# Altium project HIL_RIG_Hardware.PrjPcb (part 4 of 11)

## Sheet  Digital_Output.SchDoc
size A3; SheetNumber: 11; SheetTotal: 29
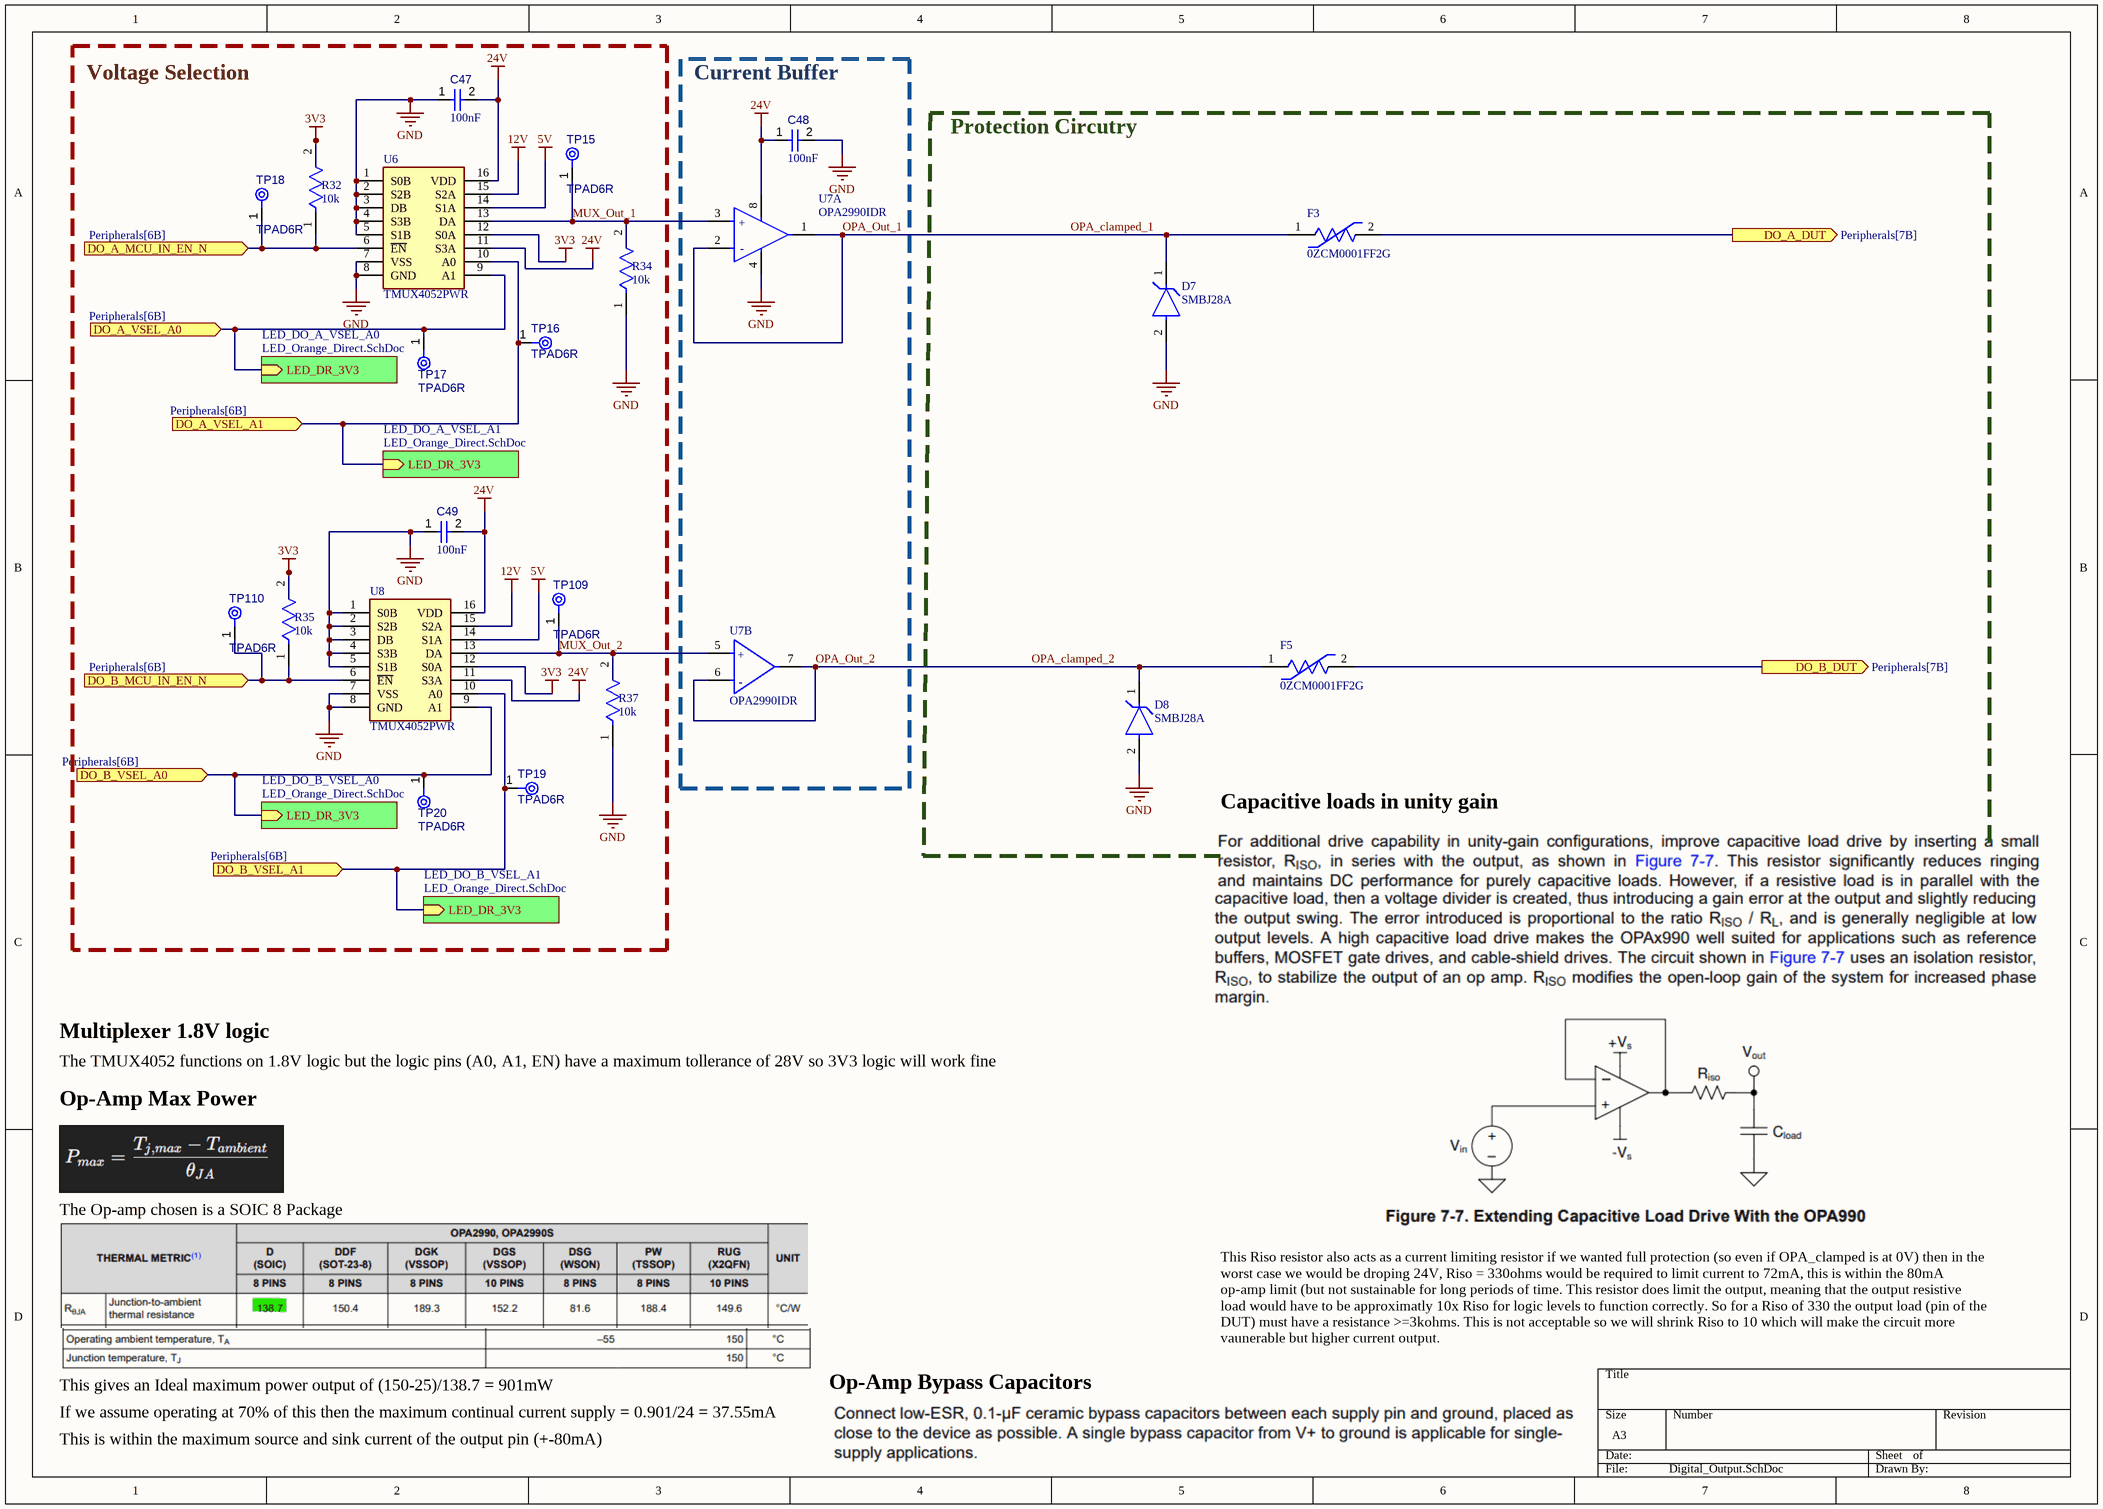
[diagram p7:  Digital_Output.SchDoc]

### Parts
C47  value 100nF  [CAPC1608X90X40NL10T20]  (hidden comment: Capacitor 100 nF +/-10% 50 V 0603)
C48  value 100nF  [CAPC1608X90X40NL10T20]  (hidden comment: Capacitor 100 nF +/-10% 50 V 0603)
C49  value 100nF  [CAPC1608X90X40NL10T20]  (hidden comment: Capacitor 100 nF +/-10% 50 V 0603)
D7  SMBJ28A  [FP-SMBJ-MFG]
D8  SMBJ28A  [FP-SMBJ-MFG]
F3  0ZCM0001FF2G  [FP-0ZCM0001FF2G-MFG]
F5  0ZCM0001FF2G  [FP-0ZCM0001FF2G-MFG]
R32  value 10k  [FP-RT0603-IPC_C]  (hidden comment: RT0603BRD0710KL)
R34  value 10k  [FP-RT0603-IPC_C]  (hidden comment: RT0603BRD0710KL)
R35  value 10k  [FP-RT0603-IPC_C]  (hidden comment: RT0603BRD0710KL)
R37  value 10k  [FP-RT0603-IPC_C]  (hidden comment: RT0603BRD0710KL)
TP15  TPAD6R  [TP06R]  (no BOM)
TP16  TPAD6R  [TP06R]  (no BOM)
TP17  TPAD6R  [TP06R]  (no BOM)
TP18  TPAD6R  [TP06R]  (no BOM)
TP19  TPAD6R  [TP06R]  (no BOM)
TP20  TPAD6R  [TP06R]  (no BOM)
TP109  TPAD6R  [TP06R]  (no BOM)
TP110  TPAD6R  [TP06R]  (no BOM)
U6  TMUX4052PWR  [SOP65P640X120-16N]
U7  OPA2990IDR  [FP-D0008A-IPC_A]  (parts A,B of 2)
U8  TMUX4052PWR  [SOP65P640X120-16N]

### Blocks framed on the sheet
Voltage Selection: C47 C49 R32 R34 R35 R37 TP15-TP20 TP109 TP110 U6 U8
Current Buffer: C48 U7

### Sub-sheets
LED_DO_A_VSEL_A0 = LED_Orange_Direct.SchDoc (file not in this document): LED_DR_3V3 (in)
LED_DO_A_VSEL_A1 = LED_Orange_Direct.SchDoc (file not in this document): LED_DR_3V3 (in)
LED_DO_B_VSEL_A0 = LED_Orange_Direct.SchDoc (file not in this document): LED_DR_3V3 (in)
LED_DO_B_VSEL_A1 = LED_Orange_Direct.SchDoc (file not in this document): LED_DR_3V3 (in)

### Ports
DO_A_DUT (out, see Peripherals[7B]), DO_A_MCU_IN_EN_N (in, see Peripherals[6B]), DO_A_VSEL_A0 (in, see Peripherals[6B]), DO_A_VSEL_A1 (in, see Peripherals[6B]), DO_B_DUT (out, see Peripherals[7B]), DO_B_MCU_IN_EN_N (in, see Peripherals[6B]), DO_B_VSEL_A0 (in, see Peripherals[6B]), DO_B_VSEL_A1 (in, see Peripherals[6B])

### Nets
3V3: R32.2 R35.2 U6.12(S0A) U8.12(S0A)
5V: U6.14(S1A) U8.14(S1A)
12V: U6.15(S2A) U8.15(S2A)
24V: C47.2 C48.1 C49.2 U6.11(S3A) U6.16(VDD) U7.8(V+) U8.11(S3A) U8.16(VDD)
GND: C47.1 C48.2 C49.1 D7.2(A) D8.2(A) R34.1 R37.1 U6.1(S0B) U6.2(S2B) U6.3(DB) U6.4(S3B) U6.5(S1B) U6.7(VSS) U6.8(GND) U7.4(V-) U8.1(S0B) U8.2(S2B) U8.3(DB) U8.4(S3B) U8.5(S1B) U8.7(VSS) U8.8(GND)
MUX_Out_1: R34.2 TP15.1(TP) U6.13(DA) U7.3(IN1+)
MUX_Out_2: R37.2 TP109.1(TP) U7.5(IN2+) U8.13(DA)
OPA_clamped_1: D7.1(C) F3.1 U7.1(OUT1) U7.2(IN1-)  [also labelled OPA_Out_1]
OPA_clamped_2: D8.1(C) F5.1 U7.6(IN2-) U7.7(OUT2)  [also labelled OPA_Out_2]
NetF3_2: F3.2 ; port DO_A_DUT
NetF5_2: F5.2 ; port DO_B_DUT
NetR32_1: R32.1 TP18.1(TP) U6.6(~{EN}) ; port DO_A_MCU_IN_EN_N
NetR35_1: R35.1 TP110.1(TP) U8.6(~{EN}) ; port DO_B_MCU_IN_EN_N
NetTP16_1: TP16.1(TP) U6.10(A0) ; port DO_A_VSEL_A1, sheet LED_DO_A_VSEL_A1/LED_DR_3V3
NetTP17_1: TP17.1(TP) U6.9(A1) ; port DO_A_VSEL_A0, sheet LED_DO_A_VSEL_A0/LED_DR_3V3
NetTP19_1: TP19.1(TP) U8.10(A0) ; port DO_B_VSEL_A1, sheet LED_DO_B_VSEL_A1/LED_DR_3V3
NetTP20_1: TP20.1(TP) U8.9(A1) ; port DO_B_VSEL_A0, sheet LED_DO_B_VSEL_A0/LED_DR_3V3

### Notes on the sheet
- Protection Circutry
- Capacitive loads in unity gain
- Multiplexer 1.8V logic
- The TMUX4052 functions on 1.8V logic but the logic pins (A0, A1, EN) have a maximum tollerance of 28V so 3V3 logic will work fine
- Op-Amp Max Power
- The Op-amp chosen is a SOIC 8 Package
- This gives an Ideal maximum power output of (150-25)/138.7 = 901mW
- Op-Amp Bypass Capacitors
- This Riso resistor also acts as a current limiting resistor if we wanted full protection (so even if OPA_clamped is at 0V) then in the worst case we would be droping 24V, Riso = 330ohms would be required to limit current to 72mA, this is within the 80mA op-amp limit (but not sustainable for long periods of time. This resistor does limit the output, meaning that the output resistive load would have to be approximatly 10x Riso for logic levels to function correctly. So for a Riso of 330 the output load (pin of the DUT) must have a resistance >=3kohms. This is not acceptable so we will shrink Riso to 10 which will make the circuit more vaunerable but higher current output.
- If we assume operating at 70% of this then the maximum continual current supply = 0.901/24 = 37.55mA
- This is within the maximum source and sink current of the output pin (+-80mA)

### Library data of the parts
C47-C49 = CMP-001-00017-6: as C28 on sheet  Digital_Input; Tolerance: 10%; Mounting Technology: SM; Max Operating Temperature: 125°C; RoHS Compliant: True; Pins: 2; Case/Package: 0603; Min Operating Temperature: -55°C
D7 D8 = CMP-004-00070-1: Tvs Diodes & Esd Suppressors; SMBJ28A; Littelfuse; 28 V; 45.4 V; 31.1 V; 31.1 V; Power Line Protection: No; Clamping Voltage: 45.4V; Number of Channels: 1; Power Rating: 600W; Voltage Rating (DC): 28V; Polarity: Unidirectional; Breakdown Voltage: 32.75V; Element Configuration: Single; Leakage Current: 1µA; Current: 1mA; Max Breakdown Voltage: 34.4V; Forward Voltage: 3.5V; Max Power Dissipation: 5W; Min Breakdown Voltage: 31.1V; Max Junction Temperature (Tj): 150°C; Max Surge Current: 13.3A; Height: 2.61mm; Number of Elements: 1; Power Dissipation: 600W; Case/Package: SMB; Termination: SMD/SMT; Radiation Hardening: No; Mounting Technology: Surface Mount; Lifecycle Status: Production; Direction: Unidirectional; Number of Unidirectional Channels: 1; Reverse Voltage: 28V; Peak Reverse Current: 1µA; Voltage: 28V; Operating Supply Voltage: 28V; Min Operating Temperature: -65°C; Schedule B: 8541100080, 8541100080; REACH SVHC: No; Length: 4.57mm; Packaging: Cut Tape; Country of Origin: Mainland China, Philippines; Test Current: 1mA; Introduction Date: 1996-01-01; Lead Free: Lead Free; Max Operating Temperature: 150°C; Composition: Zener; Pins: 2; Width: 3.94mm; Number of Terminals: 2; Reverse Standoff Voltage: 28V; Harmonized Tariff Schedule (HTS) Code: 8541.10.00.50; RoHS: Compliant; Peak Pulse Power: 600W; Export Control Classification Number (ECCN) Code: EAR99; Max Reverse Leakage Current: 1µA; Reverse Breakdown Voltage: 31.1V; Peak Pulse Current: 13.3A
F3 F5 = CMP-005-00023-1: Prices include import duty and tax. RESETTABLE PTC FUSE, SMD, 0603 SIZE, 10MA, 60V;; Trip Current: 30mA; Value: 15Ω; Maximum Resistance 1 Hour (R1max): 100Ω; Ratings: AEC-Q200, TUV; Time to Trip: 1s; Current Rating: 40A; REACH SVHC: Yes; Voltage Rating: 60V; Harmonized Tariff Schedule (HTS) Code: 8533.40.80.70; Mounting Technology: Surface Mount; Length: 1.8mm; Min Operating Temperature: -40°C; Max Operating Temperature: 85°C; Width: 1mm; Export Control Classification Number (ECCN) Code: EAR99; Height: 850µm; Working Voltage: 60V; Case/Package: 0603; RoHS: Compliant; Lifecycle Status: Production; Hold Current: 10mA; Number of Terminals: 2; China RoHS: Compliant; Introduction Date: 2019-09-26
R32 R34 R35 R37 = CMP-009-00322-1: as R7 on sheet  Digital_Input; Min Operating Temperature: -55°C; Case/Package: 0603; Mounting Technology: Surface Mount; Max Operating Temperature: 155°C; Tolerance: 0.1%; Case Code (Imperial): 0603; China RoHS: Non-Compliant; Composition: Thin Film; Country of Origin: Mainland China, Taiwan; Depth: 800µm; Export Control Classification Number (ECCN) Code: EAR99; Features: Moisture Resistant; Harmonized Tariff Schedule (HTS) Code: 8533.21.00.30; Height: 450µm; Introduction Date: 2008-06-09; Lead Free: Lead Free; Length: 1.6mm; Lifecycle Status: Production; Military Standard: Not; Number of Terminals: 2; Number of Terminations: 2; Power Rating: 100mW; REACH SVHC: Yes; RoHS: Compliant; Schedule B: 8533210045, 8533210045; Termination: SMD/SMT; Voltage Rating (DC): 75V; Weight: 2.012816mg; Width: 800µm; Working Voltage: 75V
TP15-TP20 TP109 TP110 = CMP-00028-00002-2: 0.6mm round; Pins: 1
U6 U8 = CMP-031-00021-1: Texas Instruments; Arrow Price/Stock: https://www.arrow.com/en/products/tmux4052pwr/texas-instruments.html?utm_currency=USD&region=nac; Manufacturer_Name: Texas Instruments; Manufacturer_Part_Number: TMUX4052PWR; Datasheet Link: https://www.ti.com/lit/ds/symlink/tmux4052.pdf?ts=1676371866155&ref_url=https%253A%252F%252Fwww.ti.com%252Fproduct%252FTMUX4052; Mouser Price/Stock: https://www.mouser.co.uk/ProductDetail/Texas-Instruments/TMUX4052PWR?qs=amGC7iS6iy8OsL8GnYryxg%3D%3D; Arrow Part Number: TMUX4052PWR; Height: 1.2mm; Source: MAX17643ATC+.SchLib; Design Item ID: TMUX4052PWR; Mouser Part Number: 595-TMUX4052PWR
U7 = CMP-014-00003-1: IC OPAMP GP 2 CIRCUIT 8SOIC / General Purpose Amplifier 2 Circuit Rail-to-Rail 8-SOIC; Manufacturer Lifecycle Status: ACTIVE; Output Current per Channel: 80mA; Max Junction Temperature (Tj): 150°C; Max Dual Supply Voltage: 20V; Min Dual Supply Voltage: 1.35V; Number of Channels: 2; Input Offset Voltage (Vos): 300µV; Input Bias Current: 10pA; Max Supply Voltage: 40V; Nominal Supply Current: 120µA; Min Supply Voltage: 2.7V; Ambient Temperature Range High: 125°C; Schedule B: 8542330000; Height: 1.75mm; Pins: 8; Length: 4.9mm; Width: 3.91mm; Max Operating Temperature: 125°C; Case/Package: SOIC; Lifecycle Status: Production; RoHS: Compliant; Thickness: 1.58mm; Min Operating Temperature: -40°C

## Sheet  PWM_Input.SchDoc
size A3; SheetNumber: 12; SheetTotal: 29; SPICEModelCacheULSDJOQO: <root> / <DocumentId>ULSDJOQO</DocumentId> / <CacheFrame Number="0"> / <Model Name="logic_pp_output_lvc_1i_nand_pp_cmos_sn74lvc1g04" Kind="CKT"> / <Text>.SUBCKT LOGIC_PP_OUTPUT_LVC_1i_NAND_PP_CMOS_SN74LVC1G04 IN OUT VCC VEE / EROH NROH VEE TABLE {V(VCC,VEE)} = / +(1.65,112.5) / +(2.3,50) / +(3,37.5) / +(4.5,21.875) / EROL NROL VEE TABLE {V(VCC,VEE)} = / +(1.65,112.5) / +(2.3,37.5) / +(3,25) / +(4.5,17.1875) / E1 N1 VEE VALUE = {V(VCC,VEE)*V(IN,VEE)} / GOUT N1 OUT VALUE = {V(N1,OUT)*(V(IN,VEE)/V(NROH,VEE) + (1 - V(IN,VEE))/V(NROL,VEE))} / .ENDS</Text> / </Model> / <Model Name="logic_input_lvc_1i_nand_pp_cmos_sn74lvc1g04" Kind="CKT"> / <Text>.SUBCKT LOGIC_INPUT_LVC_1i_NAND_PP_CMOS_SN74LVC1G04 OUT IN VCC VEE / .PARAM STANDARD_INPUT_SELECT = 1 / .PARAM SCHMITT_TRIGGER_INPUT_SELECT = 0 / ESTD_THR VSTD_THR VEE TABLE {V(VCC,VEE)} = / +(1,0.5) / +(1.8,0.9) / +(2.5,1.25) / +(3.3,1.65) / +(5,2.5) / +(6,3) / ETRP_P VTRP_P VEE TABLE {V(VCC,VEE)} = / +(1.65,0.9) / +(2.3,1.25) / +(3,1.7) / +(4.5,2.45) / +(5.5,3) / ETRP_N VTRP_N VEE TABLE {V(VCC,VEE)} = / +(1.65,0.45) / +(2.3,0.7) / +(3,1.05) / +(4.5,1.72) / +(5.5,2.1) / EHYST VHYST VEE TABLE {V(VCC,VEE)} = / +(1.65,0.45) / +(2.3,0.55) / +(3,0.65) / +(4.5,0.73) / +(5.5,0.9) / ETRUE NTRUE VEE VALUE = {V(VCC,VEE)} / EFALSE NFALSE VEE VALUE = {0} / EBETA BETA VEE VALUE = {V(VHYST,VEE)/(V(NTRUE,VEE) - V(NFALSE,VEE) + V(VHYST,VEE))} / EFB NFB VEE VALUE = {(1 - V(BETA,VEE))*V(IN,VEE) + V(BETA,VEE)*V(CURR_OUT,VEE)} / EREF NREF VEE VALUE = {0.5*(1 - V(BETA,VEE))*(V(VTRP_P,VEE) + V(VTRP_N,VEE)) / + + 0.5*V(BETA,VEE)*(V(NTRUE,VEE) + V(NFALSE,VEE))} / EDIFF NDIFF VEE VALUE = {V(NFB,NREF)} / ESWITCH VSWITCH VEE VALUE = {0.5*(-SGN(V(NDIFF,VEE)) + ABS(SGN(V(NDIFF,VEE))))} / ESWITCH1 VSWITCH1 VEE VALUE = {0.5*(SGN(V(NDIFF,VEE)) + ABS(SGN(V(NDIFF,VEE))))} / GCOMP VEE CURR_OUT VALUE = {SCHMITT_TRIGGER_INPUT_SELECT*0.5*V(VCC,VEE)*(SGN(V(NDIFF,VEE)) + ABS(SGN(V(NDIFF,VEE))))} / GSTD VEE CURR_OUT VALUE = {STANDARD_INPUT_SELECT*0.5*V(VCC,VEE)*(SGN(V(IN,VSTD_THR)) + ABS(SGN(V(IN,VSTD_THR))))} / ROUT CURR_OUT VEE 1 / EMID MID VEE VALUE = {0.5*(V(VCC,VEE) + V(VEE))} / EARG NARG VEE VALUE = {V(CURR_OUT,VEE) - V(MID,VEE)} / EOUT OUT VEE VALUE = {0.5*(SGN(V(NARG,VEE)) + ABS(SGN(V(NARG,VEE) ) ) )} / .PARAM MAXICC = 0.032 / .PARAM VT = .7 / .PARAM VCC_MIN = 1.65 / EV_VT1 VTN VEE VALUE = { VT } / EV_VT2 VTP VEE VALUE = { V(VCC,VEE) - VT } / ETEST TEST VEE VALUE = {.9*V(VCC,VEE)} / EVTHDIFF VTH_DIFF VEE VALUE = {V(IN,VSTD_THR)} / EVTHPDIFF VTHP_DIFF VEE VALUE = {V(IN,VTRP_P)} / EVTHNDIFF VTHN_DIFF VEE VALUE = {V(IN,VTRP_N)} / EVTNDIFF VTN_DIFF VEE VALUE = { V(IN,VTN) } / EVTPDIFF VTP_DIFF VEE VALUE = { V(IN,VTP) } / GICCVA VCC VEE VALUE = { (-ABS(( (1+SGN(V(VTN_DIFF,VEE)) ) )/2 -1) * / + 2*MAXICC*((V(IN,VEE)-VT)/V(VCC,VEE))^2)*(1 + SGN(V(VCC,VEE) - VCC_MIN))*V(VSWITCH,VEE)} / GICCVB VCC VEE VALUE = { (ABS(( (1+SGN(V(VTHP_DIFF,VEE)) ) )/2 -1) * / + 2*MAXICC*((V(IN,VEE)-VT)/V(VCC,VEE))^2)*(1 + SGN(V(VCC,VEE) - VCC_MIN))*V(VSWITCH,VEE)} / GICCVC VCC VEE VALUE = { ( ABS(  (1+SGN(V(VTHN_DIFF,VEE)) ) )/2  * / + 2*MAXICC*((V(IN,VEE)-(V(VCC,VEE)-VT))/V(VCC,VEE))^2)*(1 + SGN(V(VCC,VEE) - VCC_MIN))*V(VSWITCH1,VEE)} / GICCVD VCC VEE VALUE = { (-ABS(  (1+SGN(V(VTP_DIFF,VEE)) ) )/2  * / + 2*MAXICC*((V(IN,VEE)-(V(VCC,VEE)-VT))/V(VCC,VEE))^2)*(1 + SGN(V(VCC,VEE) - VCC_MIN))*V(VSWITCH1,VEE)} / .ENDS</Text> / </Model> / <Model Name="logic_function_2_lvc_1i_nand_pp_cmos_sn74lvc1g04" Kind="CKT"> / <Text>.SUBCKT LOGIC_FUNCTION_2_LVC_1i_NAND_PP_CMOS_SN74LVC1G04 A B OUT VCC VEE / .PARAM AND  = 0 / .PARAM NAND = 1 / .PARAM OR   = 0 / .PARAM NOR  = 0 / .PARAM XOR  = 0 / .PARAM XNOR = 0 / GAND  VEE N1 VALUE = {AND*V(A,VEE)*V(B,VEE)} / GNAND VEE N1 VALUE = {NAND*(1 - V(A,VEE)*V(B,VEE))} / GOR   VEE N1 VALUE = {OR*(MIN(V(A,VEE) + V(B,VEE),1))} / GNOR  VEE N1 VALUE = {NOR*(1 - MIN(V(A,VEE) + V(B,VEE),1))} / GXOR  VEE N1 VALUE = {XOR*((1 - V(A,VEE))*V(B,VEE) + V(A,VEE)*(1 - V(B,VEE)))} / GXNOR VEE N1 VALUE = {XNOR*(1 - ((1 - V(A,VEE))*V(B,VEE) + V(A,VEE)*(1 - V(B,VEE))))} / RN1 N1 VEE 1 / EOUT OUT VEE N1 VEE 1 / .ENDS</Text> / </Model> / <Model Name="tpd_lvc_1i_nand_pp_cmos_sn74lvc1g04" Kind="CKT"> / <Text>.SUBCKT TPD_LVC_1i_NAND_PP_CMOS_SN74LVC1G04 IN OUT VCC VEE / .PARAM TPDELAY1 = 1N / .PARAM RS = 10K / .PARAM CS = {-TPDELAY1/(RS*LOG(0.5))} / ETPDNORM NTPDNORM VEE TABLE {V(VCC,VEE)} = / +(1.8,4.3) / +(2.5,2.6) / +(3.3,2.15) / +(5,1.95) / G1 IN N1 VALUE = {V(IN,N1)/(V(NTPDNORM,VEE)*RS)} / RZ IN N1 10G / C1 N1 VEE {CS} / E1 N2 VEE VALUE = {0.5*(1 + SGN(V(N1,VEE) - 0.5))} / EOUT OUT VEE N2 VEE 1 / .ENDS</Text> / </Model> / <Model Name="logic_icc_lvc_1i_nand_pp_cmos_sn74lvc1g04" Kind="CKT"> / <Text>.SUBCKT LOGIC_ICC_LVC_1i_NAND_PP_CMOS_SN74LVC1G04 VCC VEE VIOUT / .PARAM ICC = 2.5e-07 / .PARAM VCC_MAX = 5.5 / .PARAM VCC_MIN = 1.65 / GICC VCC VEE VALUE = {ICC*0.5*(1 + SGN(V(VCC,VEE) - VCC_MIN))} / EGNDF GNDF 0 VALUE = {0.5*(V(VCC) + V(VEE))} / GOUTP VCC GNDF VALUE = {V(VIOUT,VEE)*0.5*(SGN(V(VIOUT,VEE)) + ABS(SGN(V(VIOUT,VEE))))} / GOUTN GNDF VEE VALUE = {V(VIOUT,VEE)*0.5*(SGN(V(VIOUT,VEE)) + ABS(SGN(V(VIOUT,VEE))))} / .ENDS</Text> / </Model> / <Model Name="logic_gate_2pin_od_lvc_1i_nand_pp_cmos_sn74lvc1g04" Kind="CKT"> / <Text>.SUBCKT LOGIC_GATE_2PIN_OD_LVC_1i_NAND_PP_CMOS_SN74LVC1G04 OUT A B VCC GND / .PARAM VCC_ABS_MAX = 6.5 / .PARAM VCC_MAX = 5.5 / .PARAM RA = 220000000 / .PARAM RB = 220000000 / .PARAM CA = 4.5e-12 / .PARAM CB = 4.5e-12 / .PARAM ROEZ = 5500000 / .PARAM COEZ = 6e-12 / RA  A  GND {RA} / RB  B  GND {RB} / CA  A  GND {CA} / CB  B  GND {CB} / XUA NA A VCC GND LOGIC_INPUT_LVC_1i_NAND_PP_CMOS_SN74LVC1G04 / XUB NB B VCC GND LOGIC_INPUT_LVC_1i_NAND_PP_CMOS_SN74LVC1G04 / XUG NA NB NOUTG VCC GND LOGIC_FUNCTION_2_LVC_1i_NAND_PP_CMOS_SN74LVC1G04 / XOUTPD NOUTG NOUTTPD VCC GND TPD_LVC_1i_NAND_PP_CMOS_SN74LVC1G04 / XUOUT NOUTTPD NOUT_INT VCC GND LOGIC_PP_OUTPUT_LVC_1i_NAND_PP_CMOS_SN74LVC1G04 / XICC VCC GND NVIOUT LOGIC_ICC_LVC_1i_NAND_PP_CMOS_SN74LVC1G04 / SICC VCC GND VCC GND SW1 / H1 NVIOUT GND VIOUT 1 / VIOUT NOUT_INT OUTsw 0 / SIOFF OUTsw OUT VCC GND SW2 / DA2 GND A D1 / DB2 GND B D1 / DO2 GND OUT D1 / RDA1 NA1 GND 1e6 / SDA1 NA1 A VCC GND SW2 / RDB1 NB1 GND 1e6 / SDB1 NB1 B VCC GND SW2 / RDO1 NO1 GND 1e6 / SDO1 NO1 OUT VCC GND SW2 / .MODEL SW1 VSWITCH VON = {VCC_ABS_MAX} VOFF = {VCC_MAX} RON = 10 ROFF = 60e6 / .MODEL SW2 VSWITCH VON = {0.55} VOFF = {0.45} RON = 10m ROFF = 100e6 / .MODEL D1 D / .ENDS</Text> / <Dependency>0\logic_pp_output_lvc_1i_nand_pp_cmos_sn74lvc1g04</Dependency> / <Dependency>0\logic_input_lvc_1i_nand_pp_cmos_sn74lvc1g04</Dependency> / <Dependency>0\logic_function_2_lvc_1i_nand_pp_cmos_sn74lvc1g04</Dependency> / <Dependency>0\tpd_lvc_1i_nand_pp_cmos_sn74lvc1g04</Dependency> / <Dependency>0\logic_icc_lvc_1i_nand_pp_cmos_sn74lvc1g04</Dependency> / </Model> / <Model Name="sn74lvc1g04" Kind="CKT"> / <Text>******************************************************************************** / * SN74LVC04A.cir / * 2.0 / * 2019-11-14 00:00:00 / * Texas Instruments Incorporated. / * Standard Logic, SLHR / * 12500 TI Blvd / * Dallas, TX -75243 / * / * Revision History: / * Rev 2.0: 01/01/2019 / * - Model generated from datasheet values / * - Built using generic logic gate behavioral pspice model V2 / * - Built using an automated model which generalizes parts under same family / * - Performance is expected typical behavior at 25C / * - Written for and tested with Tina-TI Version 9.3.100.244 SF-TI / * - Accurate power consumption with dyanmic as well as static Icc / * / ******************************************************************************** / *[Disclaimer] / * This model is designed as an aid for customers of Texas Instruments. / * TI and its licensors and suppliers make no warranties, either expressed / * or implied, with respect to this  model, including the warranties of / * merchantability or fitness for a particular purpose. The model is / * provided solely on an "as is" basis. The entire risk as to its quality / * and performance is with the customer. / * / *[Copyright] / *(C) Copyright 2019 Texas Instruments Incorporated.All rights reserved. / * / * / ******************************************************************************** / *                                 SN74LVC04A / ******************************************************************************** / .SUBCKT SN74LVC1G04 Y A VCC AGND / XU1 Y A VCC VCC AGND LOGIC_GATE_2PIN_OD_LVC_1i_NAND_PP_CMOS_SN74LVC1G04 / .ENDS</Text> / <Dependency>0\logic_gate_2pin_od_lvc_1i_nand_pp_cmos_sn74lvc1g04</Dependency> / </Model> / </CacheFrame> / </root>
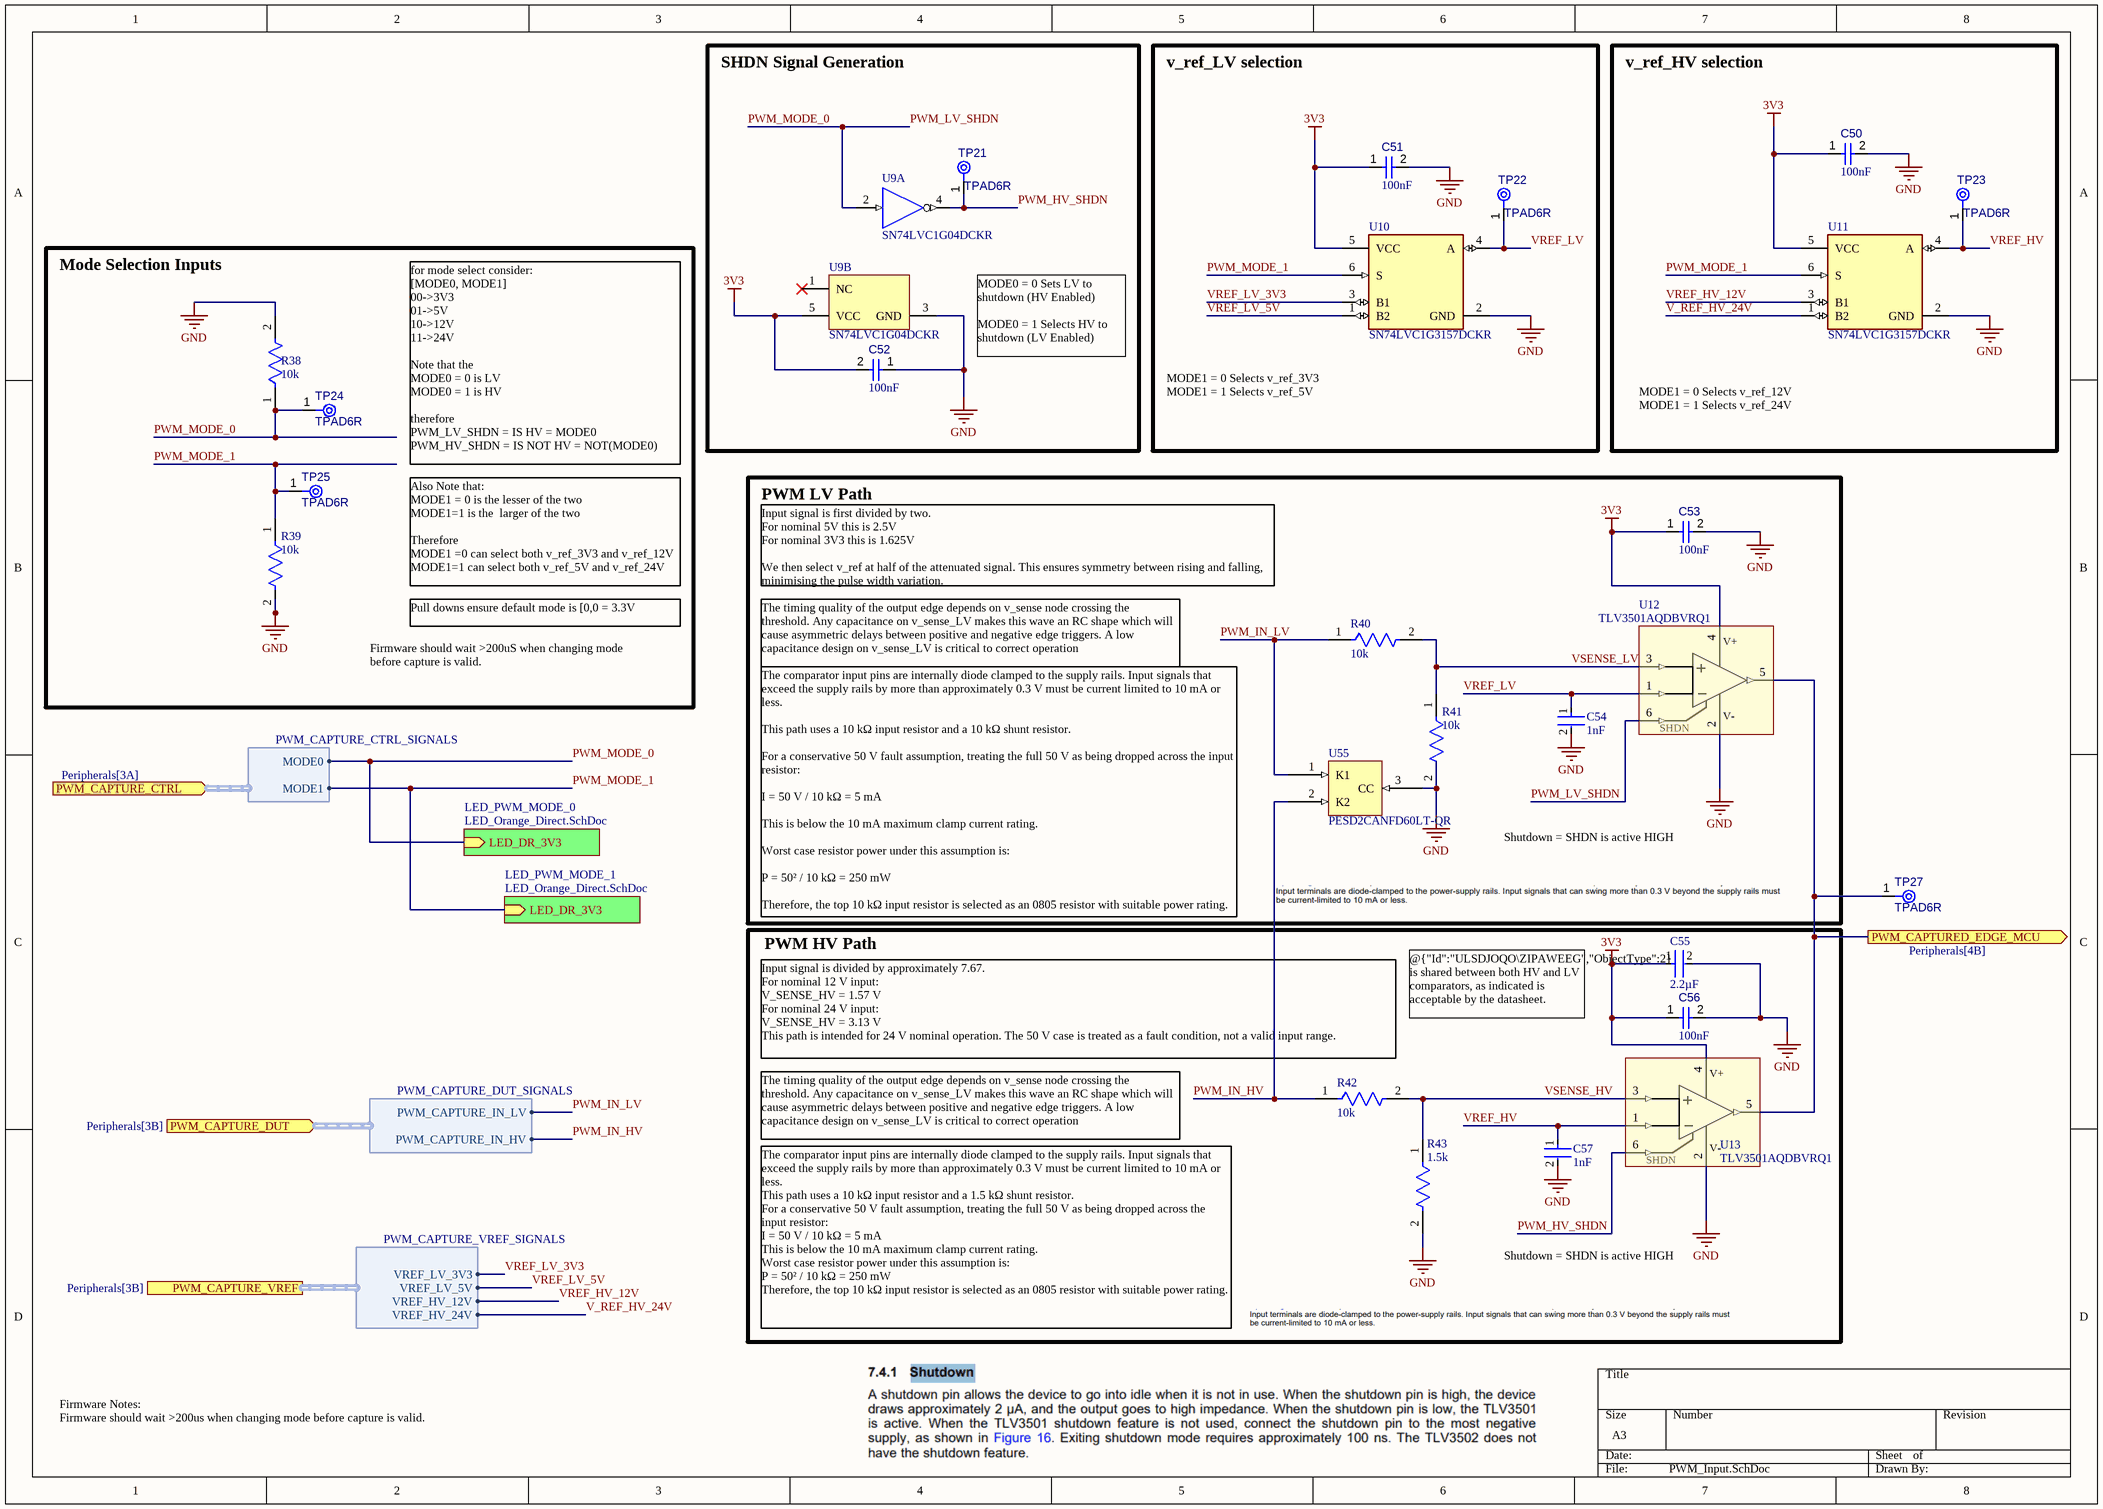
[diagram p8:  PWM_Input.SchDoc]

### Parts
C50  value 100nF  [CAPC1608X90X40ML10T20]  (hidden comment: Capacitor 100 nF +/-10% 50 V 0603)
C51  value 100nF  [CAPC1608X90X40NL10T20]  (hidden comment: Capacitor 100 nF +/-10% 50 V 0603)
C52  value 100nF  [CAPC1608X90X40ML10T20]  (hidden comment: Capacitor 100 nF +/-10% 50 V 0603)
C53  value 100nF  [CAPC1608X90X40ML10T20]  (hidden comment: Capacitor 100 nF +/-10% 50 V 0603)
C54  value 1nF  [FP-CC0603-DA-IPC_B]  (hidden comment: CC0603KRX7R7BB102)
C55  value 2.2µF  [FP-GRM188-0_1-e0_2_0_5-IPC_B]  (hidden comment: GRM188R71A225KE15D)
C56  value 100nF  [CAPC1608X90X40ML10T20]  (hidden comment: Capacitor 100 nF +/-10% 50 V 0603)
C57  value 1nF  [FP-CC0603-DA-IPC_B]  (hidden comment: CC0603KRX7R7BB102)
R38  value 10k  [FP-RT0603-IPC_C]  (hidden comment: RT0603BRD0710KL)
R39  value 10k  [FP-RT0603-IPC_A]  (hidden comment: RT0603BRD0710KL)
R40  value 10k  [FP-ESR18-IPC_A]  (hidden comment: ESR18EZPF1002)
R41  value 10k  [FP-RT0603-IPC_A]  (hidden comment: RT0603BRD0710KL)
R42  value 10k  [FP-ESR18-IPC_A]  (hidden comment: ESR18EZPF1002)
R43  value 1.5k  [FP-RT0603-IPC_C]  (hidden comment: RT0603BRD071K5L)
TP21  TPAD6R  [TP06R]  (no BOM)
TP22  TPAD6R  [TP06R]  (no BOM)
TP23  TPAD6R  [TP06R]  (no BOM)
TP24  TPAD6R  [TP06R]  (no BOM)
TP25  TPAD6R  [TP06R]  (no BOM)
TP27  TPAD6R  [TP06R]  (no BOM)
U9  SN74LVC1G04DCKR  [DCK0005A_N]  (parts A,B of 2)
U10  SN74LVC1G3157DCKR  [FP-DCK0006A-MFG]
U11  SN74LVC1G3157DCKR  [FP-DCK0006A-MFG]
U12  TLV3501AQDBVRQ1  [SOT95P280X145-6M]
U13  TLV3501AQDBVRQ1  [SOT95P280X145-6M]
U55  PESD2CANFD60LT-QR  [SOT95P230X110-3M]

### Blocks framed on the sheet
SHDN Signal Generation: C52 TP21 U9
v_ref_LV selection: C51 TP22 U10
v_ref_HV selection: C50 TP23 U11
Mode Selection Inputs: R38 R39 TP24 TP25
PWM LV Path: C53 C54 R40 R41 U12 U55
PWM HV Path: C55-C57 R42 R43 U13

### Sub-sheets
LED_PWM_MODE_0 = LED_Orange_Direct.SchDoc (file not in this document): LED_DR_3V3 (in)
LED_PWM_MODE_1 = LED_Orange_Direct.SchDoc (file not in this document): LED_DR_3V3 (in)

### Ports
PWM_CAPTURE_CTRL (in, harness PWM_CAPTURE_CTRL_SIGNALS, see Peripherals[3A]), PWM_CAPTURE_DUT (in, harness PWM_CAPTURE_DUT_SIGNALS, see Peripherals[3B]), PWM_CAPTURE_VREF (harness PWM_CAPTURE_VREF_SIGNALS, see Peripherals[3B]), PWM_CAPTURED_EDGE_MCU (out, see Peripherals[4B])

### Harnesses
PWM_CAPTURE_CTRL_SIGNALS: MODE0, MODE1
PWM_CAPTURE_DUT_SIGNALS: PWM_CAPTURE_IN_LV, PWM_CAPTURE_IN_HV
PWM_CAPTURE_VREF_SIGNALS: VREF_HV_12V, VREF_HV_24V, VREF_LV_3V3, VREF_LV_5V

### Nets
3V3: C50.1 C51.1 C52.2 C53.1 C55.1 C56.1 U9.5(VCC) U10.5(VCC) U11.5(VCC) U12.4(V+) U13.4(V+)
GND: C50.2 C51.2 C52.1 C53.2 C54.2 C55.2 C56.2 C57.2 R38.2 R39.2 R41.2 R43.2 U9.3(GND) U10.2(GND) U11.2(GND) U12.2(V-) U13.2(V-) U55.3(CC)
PWM_HV_SHDN: TP21.1(TP) U9.4(Y) U13.6(SD)
PWM_IN_HV: R42.1 U55.2(K2) ; port PWM_CAPTURE_DUT.PWM_CAPTURE_IN_HV
PWM_IN_LV: R40.1 U55.1(K1) ; port PWM_CAPTURE_DUT.PWM_CAPTURE_IN_LV
PWM_LV_SHDN: R38.1 TP24.1(TP) U9.2(A) U12.6(SD) ; sheet LED_PWM_MODE_0/LED_DR_3V3, port PWM_CAPTURE_CTRL.MODE0  [also labelled PWM_MODE_0]
PWM_MODE_1: R39.1 TP25.1(TP) U10.6(S) U11.6(S) ; sheet LED_PWM_MODE_1/LED_DR_3V3, port PWM_CAPTURE_CTRL.MODE1
V_REF_HV_24V: U11.1(B2) ; port PWM_CAPTURE_VREF.VREF_HV_24V
VREF_HV: C57.1 TP23.1(TP) U11.4(A) U13.1(IN-)
VREF_HV_12V: U11.3(B1) ; port PWM_CAPTURE_VREF.VREF_HV_12V
VREF_LV: C54.1 TP22.1(TP) U10.4(A) U12.1(IN-)
VREF_LV_3V3: U10.3(B1) ; port PWM_CAPTURE_VREF.VREF_LV_3V3
VREF_LV_5V: U10.1(B2) ; port PWM_CAPTURE_VREF.VREF_LV_5V
VSENSE_HV: R42.2 R43.1 U13.3(IN+)
VSENSE_LV: R40.2 R41.1 U12.3(IN+)
NetTP27_1: TP27.1(TP) U12.5(OUT) U13.5(OUT) ; port PWM_CAPTURED_EDGE_MCU

Not connected (* = marked no-connect by the designer): U9 1(NC)*

### Notes on the sheet
- MODE0 = 0 Sets LV to shutdown (HV Enabled)
  MODE0 = 1 Selects HV to shutdown (LV Enabled)
- MODE1 = 0 Selects v_ref_3V3
  MODE1 = 1 Selects v_ref_5V
- MODE1 = 0 Selects v_ref_12V
  MODE1 = 1 Selects v_ref_24V
- for mode select consider:
  [MODE0, MODE1]
  00->3V3
  01->5V
  10->12V
  11->24V
  Note that the
  MODE0 = 0 is LV
  MODE0 = 1 is HV
  therefore
  PWM_LV_SHDN = IS HV = MODE0
  PWM_HV_SHDN = IS NOT HV = NOT(MODE0)
- Also Note that:
  MODE1 = 0 is the lesser of the two
  MODE1=1 is the  larger of the two
  Therefore
  MODE1 =0 can select both v_ref_3V3 and v_ref_12V
  MODE1=1 can select both v_ref_5V and v_ref_24V
- Input signal is first divided by two.
  For nominal 5V this is 2.5V
  For nominal 3V3 this is 1.625V
  We then select v_ref at half of the attenuated signal. This ensures symmetry between rising and falling, minimising the pulse width variation.
- Pull downs ensure default mode is [0,0 = 3.3V
- Firmware should wait >200uS when changing mode before capture is valid.
- The timing quality of the output edge depends on v_sense node crossing the threshold. Any capacitance on v_sense_LV makes this wave an RC shape which will cause asymmetric delays between positive and negative edge triggers. A low capacitance design on v_sense_LV is critical to correct operation
- Shutdown = SHDN is active HIGH
- The comparator input pins are internally diode clamped to the supply rails. Input signals that exceed the supply rails by more than approximately 0.3 V must be current limited to 10 mA or less.
  This path uses a 10 kΩ input resistor and a 10 kΩ shunt resistor.
  For a conservative 50 V fault assumption, treating the full 50 V as being dropped across the input resistor:
  I = 50 V / 10 kΩ = 5 mA
  This is below the 10 mA maximum clamp current rating.
  Worst case resistor power under this assumption is:
  P = 50² / 10 kΩ = 250 mW
  Therefore, the top 10 kΩ input resistor is selected as an 0805 resistor with suitable power rating.
- (near R42) Input signal is divided by approximately 7.67.
  For nominal 12 V input:
  V_SENSE_HV = 1.57 V
  For nominal 24 V input:
  V_SENSE_HV = 3.13 V
  This path is intended for 24 V nominal operation. The 50 V case is treated as a fault condition, not a valid input range.
- @{"Id":"ULSDJOQO\ZIPAWEEG","ObjectType":2} is shared between both HV and LV comparators, as indicated is acceptable by the datasheet.
- The comparator input pins are internally diode clamped to the supply rails. Input signals that exceed the supply rails by more than approximately 0.3 V must be current limited to 10 mA or less.
  This path uses a 10 kΩ input resistor and a 1.5 kΩ shunt resistor.
  For a conservative 50 V fault assumption, treating the full 50 V as being dropped across the input resistor:
  I = 50 V / 10 kΩ = 5 mA
  This is below the 10 mA maximum clamp current rating.
  Worst case resistor power under this assumption is:
  P = 50² / 10 kΩ = 250 mW
  Therefore, the top 10 kΩ input resistor is selected as an 0805 resistor with suitable power rating.
- Firmware Notes:
  Firmware should wait >200us when changing mode before capture is valid.

### Library data of the parts
C50-C53 C56 = CMP-001-00017-6: as C28 on sheet  Digital_Input; Tolerance: 10%; Mounting Technology: SM; Max Operating Temperature: 125°C; RoHS Compliant: True; Pins: 2; Case/Package: 0603; Min Operating Temperature: -55°C
C54 C57 = CMP-001-00137-1: as C29 on sheet  Digital_Input; Min Operating Temperature: -55°C; Dielectric Material: Ceramic; Max Operating Temperature: 125°C; REACH SVHC: Yes; Lifecycle Status: Production; Voltage Rating: 16V; Mounting Technology: Surface Mount; Width: 800µm; Height: 800µm; Case/Package: 0603; RoHS: Compliant; Voltage Rating (DC): 16V; Length: 1.6mm; Number of Terminals: 2; Tolerance: 10%; Dielectric: X7R; Material: Ceramic; China RoHS: Compliant; Case Code (Imperial): 0603; Case Code (Metric): 1608; Composition: Ceramic; Depth: 800µm; Halogen Free: Halogen Free; Lead Free: Lead Free; Packaging: Tape and Reel; Radiation Hardening: No; Schedule B: 8532240020, 8532240020; Termination: SMD/SMT; Thickness: 889µm; Weight: 2.012816mg
C55 = CMP-001-00142-1: 10V 2.2uF X7R ±10% 0603 Multilayer Ceramic Capacitors MLCC - SMD/SMT ROHS; Manufacturer Lifecycle Status: IN PRODUCTION; Weight: 2.012816mg; Voltage Rating (DC): 10V; Voltage: 10V; Country of Origin: Philippines; Width: 800µm; Height: 800µm; Length: 1.6mm; Dielectric Material: Ceramic; Case Code (Imperial): 0603; Schedule B: 8532240020, 8532240020; Termination: SMD/SMT; Harmonized Tariff Schedule (HTS) Code: 8532.24.00.20; Number of Terminals: 2; Material: Ceramic; Voltage Rating: 10V; Packaging: Cut Tape; Thickness: 800µm; Depth: 800µm; Dielectric: X7R; Mounting Technology: Surface Mount; Tolerance: 10%; Lead Free: Lead Free; Lifecycle Status: Production; Export Control Classification Number (ECCN) Code: EAR99; Case Code (Metric): 1608; Min Operating Temperature: -55°C; REACH SVHC: Yes; Introduction Date: 2006-06-22; Pins: 2; Case/Package: 0603; Max Operating Temperature: 125°C; RoHS: Compliant
R38 R39 R41 = CMP-009-00322-1: as R7 on sheet  Digital_Input; Min Operating Temperature: -55°C; Case/Package: 0603; Mounting Technology: Surface Mount; Max Operating Temperature: 155°C; Tolerance: 0.1%; Case Code (Imperial): 0603; China RoHS: Non-Compliant; Composition: Thin Film; Country of Origin: Mainland China, Taiwan; Depth: 800µm; Export Control Classification Number (ECCN) Code: EAR99; Features: Moisture Resistant; Harmonized Tariff Schedule (HTS) Code: 8533.21.00.30; Height: 450µm; Introduction Date: 2008-06-09; Lead Free: Lead Free; Length: 1.6mm; Lifecycle Status: Production; Military Standard: Not; Number of Terminals: 2; Number of Terminations: 2; Power Rating: 100mW; REACH SVHC: Yes; RoHS: Compliant; Schedule B: 8533210045, 8533210045; Termination: SMD/SMT; Voltage Rating (DC): 75V; Weight: 2.012816mg; Width: 800µm; Working Voltage: 75V
R40 R42 = CMP-009-00330-1: Res Thick Film 1206 10K Ohm 1% 0.5W(1/2W) ±100ppm/C Pad SMD T/R Automotive AEC-Q200; Voltage Rating: 200V; Max Power Dissipation: 333mW; Temperature Coefficient: 100ppm/°C; Ratings: AEC-Q200, IATF 16949; Power Rating: 500mW; Min Operating Temperature: -55°C; Case Code (Metric): 3216; Features: Automotive AEC-Q200; Introduction Date: 2007-08-28; Tolerance: 1%; Width: 1.6mm; Case Code (Imperial): 1206; Lifecycle Status: Production; Case/Package: 1206; Harmonized Tariff Schedule (HTS) Code: 8533.21.00.30; Packaging: Tape & Reel (TR); Length: 3.2mm; Mounting Technology: Surface Mount; Max Operating Temperature: 155°C; Export Control Classification Number (ECCN) Code: EAR99; REACH SVHC: Yes; Height: 550µm; Country of Origin: Philippines, Thailand; Working Voltage: 200V; RoHS: Compliant; Composition: Thick Film; Number of Terminals: 2; Number of Terminations: 2
R43 = CMP-009-00351-1: Res Thin Film 0603 1.5K Ohm 0.1% 1/10W ±25ppm/°C Molded SMD SMD Paper T/R; Voltage Rating: 75V; Max Power Dissipation: 100mW; Voltage Rating (DC): 50V; Mounting Technology: Surface Mount; Max Operating Temperature: 155°C; Depth: 800µm; Tolerance: 0.1%; Width: 800µm; Contact Plating: Tin; REACH SVHC: Yes; Working Voltage: 75V; Case/Package: 0603; Number of Terminals: 2; Termination: SMD/SMT; Military Standard: Not; Height: 450µm; Lifecycle Status: Production; Features: Moisture Resistant; Composition: Thin Film; Number of Terminations: 2; Lead Free: Lead Free; Radiation Hardening: No; Temperature Coefficient: 25ppm/°C; Length: 1.6mm; RoHS: Compliant; Min Operating Temperature: -55°C; Power Rating: 100mW; China RoHS: Non-Compliant; Schedule B: 8533210045, 8533210045; Case Code (Imperial): 0603; Country of Origin: Mainland China, Taiwan; Export Control Classification Number (ECCN) Code: EAR99; Harmonized Tariff Schedule (HTS) Code: 8533.21.00.30; Introduction Date: 2008-06-09
TP21-TP25 TP27 = CMP-00028-00002-2: 0.6mm round; Pins: 1
U9 = CMP-016-00022-1: IC SINGLE INVERTER GATE SC70-5 / Inverter 1-Element CMOS 5-Pin SC-70 T/R; Manufacturer Lifecycle Status: ACTIVE; Number of Bits: 1; Max Output current: 32mA; Max Supply Voltage: 5.5V; Turn-On Delay Time: 7.5ns; High Level Output Current: -32mA; Propagation Delay: 3.7ns; Quiescent Current: 10µA; Schmitt Trigger Input: No; Min Supply Voltage: 1.65V; Packaging: Cut Tape; REACH SVHC: No; Logic Function: Inverter; Output Current: 32mA; Lifecycle Status: Production; Lead Free: Lead Free; Low Level Output Current: 32mA; Min Operating Temperature: -40°C; Max Operating Temperature: 125°C; Number of Circuits: 1; Weight: 2.494758mg; Length: 2mm; Number of Elements: 1; Pins: 5; Number of Gates: 1; Width: 1.25mm; Number of Channels: 1; Thickness: 900µm; Radiation Hardening: No; RoHS: Compliant; Termination: SMD/SMT; Number of Outputs: 1; Height: 1.1mm; Number of Inputs: 1; Schedule B: 8542390000, 8542390000; Case/Package: SC; Mounting Technology: Surface Mount
U10 U11 = CMP-011-00020-2: Single-pole Double-throw Analog Switch SPDT, 1 Func, 1 Channel, Cmos, PDSO6; Manufacturer Lifecycle Status: ACTIVE; Number of Circuits: 1; Drain to Source Resistance: 11Ω; High Level Output Current: 128mA; Number of Inputs: 2; Min Supply Voltage: 1.65V; Max Supply Current: 10µA; Polarity: Non-Inverting; -3db Bandwidth: 340MHz; Nominal Supply Current: 1µA; Bandwidth: 300MHz; Interface: I2C, SPI, UART; Propagation Delay: 2ns; Max Junction Temperature (Tj): 150°C; Supply Type: Single; Turn-On Delay Time: 5.7ns; Value: 15Ω; On-State Resistance: 6Ω; Max Supply Voltage: 5.5V; Turn-Off Delay Time: 3.8ns; Lifecycle Status: Production; Min Operating Temperature: -40°C; Width: 1.25mm; RoHS: Compliant; Packaging: Cut Tape; Radiation Hardening: No; Number of Channels: 1; Height: 1.1mm; Termination: SMD/SMT; Length: 2mm; Low Level Output Current: 128mA; Case/Package: SC; Operating Supply Current: 1µA; Number of Outputs: 1; Schedule B: 8542390000, 8542390000; Max Operating Temperature: 125°C; Number of Bits: 1; Pins: 6; Weight: 2.494758mg; Frequency: 340MHz; Throw Configuration: SPDT; Mounting Technology: Surface Mount; Contact Plating: Gold; Ambient Temperature Range High: 125°C; Lead Free: Lead Free; REACH SVHC: No; Thickness: 900µm
U12 U13 = CMP-031-00017-7: Automotive-grade, high-speed, single rail-to-rail comparator with shutdown function 6-SOT-23 -40 to 125; Manufacturer_Name: Texas Instruments; Copyright: Copyright (C) 2025 Ultra Librarian. All rights reserved.; Design Item ID: TLV3501AQDBVRQ1; Source: TLV3501AQDBVRQ1.SchLib; Manufacturer_Part_Number: TLV3501AQDBVRQ1; RefDes: RefDes; TYPE: TYPE
U55 = CMP-004-00076-1: Esd Protection Device, 79V, SOT-23-3 Rohs Compliant: Yes; Introduction Date: 2025-01-23; Harmonized Tariff Schedule (HTS) Code: 8541.10.00.50; Lifecycle Status: Production; Export Control Classification Number (ECCN) Code: EAR99; RoHS: Compliant